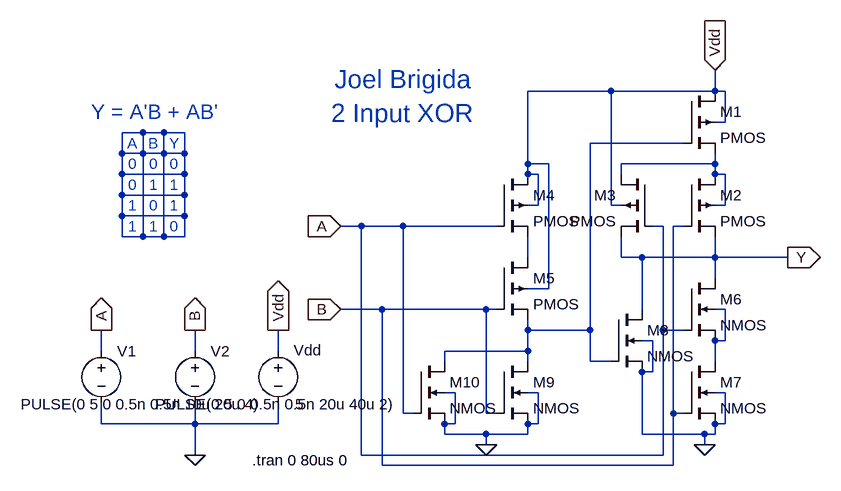
[diagram p0: schematic 2XOR.asc]
2XOR.asc, the LTspice schematic file:
Version 4
SHEET 1 880 680
WIRE 160 32 32 32
WIRE 320 32 320 0
WIRE 320 32 160 32
WIRE 336 32 320 32
WIRE 336 80 336 32
WIRE 336 80 320 80
WIRE -560 96 -592 96
WIRE -528 96 -560 96
WIRE -496 96 -528 96
WIRE 272 112 128 112
WIRE -592 128 -592 96
WIRE -560 128 -560 96
WIRE -560 128 -592 128
WIRE -528 128 -528 96
WIRE -528 128 -560 128
WIRE -496 128 -496 96
WIRE -496 128 -528 128
WIRE 32 144 32 32
WIRE 64 144 32 144
WIRE 320 144 320 128
WIRE 320 144 176 144
WIRE -592 160 -592 128
WIRE -496 160 -496 128
WIRE -496 160 -592 160
WIRE 32 160 32 144
WIRE 48 160 32 160
WIRE 176 160 176 144
WIRE 320 160 320 144
WIRE 336 160 320 160
WIRE -592 192 -592 160
WIRE -496 192 -496 160
WIRE -496 192 -592 192
WIRE 48 208 48 160
WIRE 48 208 32 208
WIRE 160 208 160 32
WIRE 176 208 160 208
WIRE 336 208 336 160
WIRE 336 208 320 208
WIRE -592 224 -592 192
WIRE -496 224 -496 192
WIRE -496 224 -592 224
WIRE -224 240 -256 240
WIRE -160 240 -224 240
WIRE -16 240 -160 240
WIRE 240 240 224 240
WIRE 272 240 256 240
WIRE -592 256 -592 224
WIRE -560 256 -560 128
WIRE -560 256 -592 256
WIRE -528 256 -528 128
WIRE -528 256 -560 256
WIRE -496 256 -496 224
WIRE -496 256 -528 256
WIRE 32 288 32 256
WIRE 176 288 176 256
WIRE 208 288 176 288
WIRE 320 288 320 256
WIRE 320 288 208 288
WIRE 432 288 320 288
WIRE 320 320 320 288
WIRE 64 336 64 144
WIRE 64 336 32 336
WIRE -192 368 -256 368
WIRE -32 368 -192 368
WIRE -16 368 -32 368
WIRE 208 368 208 288
WIRE 336 368 320 368
WIRE 32 400 32 384
WIRE 128 400 128 112
WIRE 128 400 32 400
WIRE 240 400 240 240
WIRE 272 400 240 400
WIRE 224 416 208 416
WIRE 336 416 336 368
WIRE 336 416 320 416
WIRE -624 432 -624 400
WIRE -480 432 -480 400
WIRE -352 432 -352 400
WIRE 32 432 32 400
WIRE 32 432 -96 432
WIRE -96 448 -96 432
WIRE 32 448 32 432
WIRE 128 448 128 400
WIRE 160 448 128 448
WIRE 320 448 320 416
WIRE 224 464 224 416
WIRE 224 464 208 464
WIRE -80 496 -96 496
WIRE 48 496 32 496
WIRE 336 496 320 496
WIRE -160 528 -160 240
WIRE -144 528 -160 528
WIRE -32 528 -32 368
WIRE -16 528 -32 528
WIRE 256 528 256 240
WIRE 272 528 256 528
WIRE -624 544 -624 512
WIRE -480 544 -480 512
WIRE -480 544 -624 544
WIRE -352 544 -352 512
WIRE -352 544 -480 544
WIRE -80 544 -80 496
WIRE -80 544 -96 544
WIRE 48 544 48 496
WIRE 48 544 32 544
WIRE 336 544 336 496
WIRE 336 544 320 544
WIRE -96 560 -96 544
WIRE -32 560 -96 560
WIRE 32 560 32 544
WIRE 32 560 -32 560
WIRE 208 560 208 464
WIRE 304 560 208 560
WIRE 320 560 320 544
WIRE 320 560 304 560
WIRE -32 576 -32 560
WIRE 304 576 304 560
WIRE -480 592 -480 544
WIRE -224 592 -224 240
WIRE 240 592 240 400
WIRE 240 592 -224 592
WIRE -192 608 -192 368
WIRE 256 608 256 528
WIRE 256 608 -192 608
FLAG 320 0 Vdd
IOPIN 320 0 In
FLAG -32 576 0
FLAG 304 576 0
FLAG -256 240 A
IOPIN -256 240 In
FLAG -256 368 B
IOPIN -256 368 In
FLAG 432 288 Y
IOPIN 432 288 Out
FLAG -480 592 0
FLAG -352 400 Vdd
IOPIN -352 400 Out
FLAG -480 400 B
IOPIN -480 400 Out
FLAG -624 400 A
IOPIN -624 400 Out
SYMBOL pmos4 272 32 R0
SYMATTR InstName M1
SYMBOL pmos4 272 160 R0
SYMATTR InstName M2
SYMBOL pmos4 224 160 M0
SYMATTR InstName M3
SYMBOL pmos4 -16 160 R0
SYMATTR InstName M4
SYMBOL pmos4 -16 288 R0
SYMATTR InstName M5
SYMBOL nmos4 272 320 R0
SYMATTR InstName M6
SYMBOL nmos4 272 448 R0
SYMATTR InstName M7
SYMBOL nmos4 160 368 R0
SYMATTR InstName M8
SYMBOL nmos4 -16 448 R0
SYMATTR InstName M9
SYMBOL nmos4 -144 448 R0
SYMATTR InstName M10
SYMBOL voltage -624 416 R0
WINDOW 3 -124 98 Left 2
WINDOW 123 0 0 Left 0
WINDOW 39 0 0 Left 0
SYMATTR Value PULSE(0 5 0 0.5n 0.5n 10u 20u 4)
SYMATTR InstName V1
SYMBOL voltage -480 416 R0
WINDOW 3 -61 98 Left 2
WINDOW 123 0 0 Left 0
WINDOW 39 0 0 Left 0
SYMATTR Value PULSE(0 5 0 0.5n 0.5n 20u 40u 2)
SYMATTR InstName V2
SYMBOL voltage -352 416 R0
WINDOW 0 24 15 Left 2
WINDOW 3 26 98 Left 2
WINDOW 123 0 0 Left 0
WINDOW 39 0 0 Left 0
SYMATTR InstName Vdd
SYMATTR Value 5
TEXT -392 600 Left 2 !.tran 0 80us 0
TEXT -160 40 Center 4 ;Joel Brigida\n2 Input XOR
TEXT -544 64 Center 3 ;Y = A'B + AB'
TEXT -576 112 Center 2 ;A
TEXT -544 112 Center 2 ;B
TEXT -512 112 Center 2 ;Y
TEXT -576 240 Center 2 ;1
TEXT -576 208 Center 2 ;1
TEXT -544 176 Center 2 ;1
TEXT -544 240 Center 2 ;1
TEXT -512 176 Center 2 ;1
TEXT -512 208 Center 2 ;1
TEXT -512 144 Center 2 ;0
TEXT -544 144 Center 2 ;0
TEXT -576 144 Center 2 ;0
TEXT -576 176 Center 2 ;0
TEXT -544 208 Center 2 ;0
TEXT -512 240 Center 2 ;0

The netlist it stands for:
* 2XOR.asc
M1 Vdd N002 N003 Vdd PMOS
M2 N003 B Y N003 PMOS
M3 N003 A Y Vdd PMOS
M4 Vdd A N004 Vdd PMOS
M5 N004 B N002 Vdd PMOS
M6 Y A N005 N005 NMOS
M7 N005 B 0 0 NMOS
M8 Y N002 0 0 NMOS
M9 N002 B 0 0 NMOS
M10 N002 A 0 0 NMOS
V1 A 0 PULSE(0 5 0 0.5n 0.5n 10u 20u 4)
V2 B 0 PULSE(0 5 0 0.5n 0.5n 20u 40u 2)
Vdd Vdd 0 5
.model NMOS NMOS
.model PMOS PMOS
.lib standard.mos
.tran 0 80us 0
* Joel Brigida
* 2 Input XOR
* Y = A'B + AB'
* A
* B
* Y
* 1
* 1
* 1
* 1
* 1
* 1
* 0
* 0
* 0
* 0
* 0
* 0
.backanno
.end